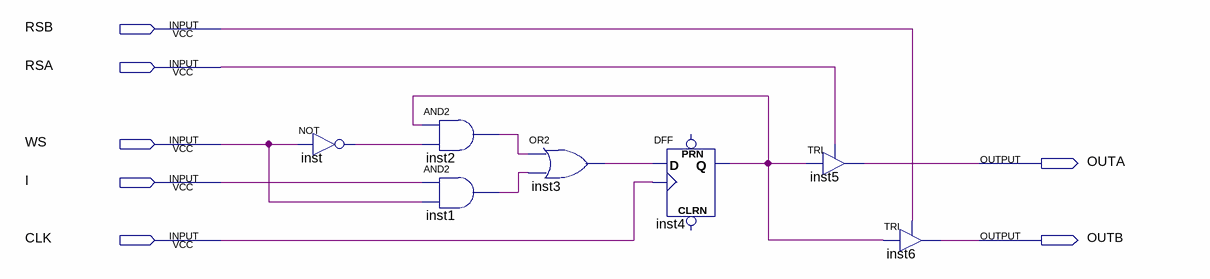
[diagram p0: schematic sheet]
// Quartus schematic RFC.bdf as structural Verilog: 7 symbols, 7 pins
module RFC (
  input  RSB,
  input  RSA,
  input  WS,
  input  I,
  input  CLK,
  output OUTA,
  output OUTB
);

  wire inst1_out, inst2_out, inst3_out, inst4_q, inst_out;

  not inst (inst_out, WS);
  and inst2 (inst2_out, inst4_q, inst_out);
  and inst1 (inst1_out, I, WS);
  or inst3 (inst3_out, inst2_out, inst1_out);
  DFF inst4 (.CLK(CLK), .D(inst3_out), .Q(inst4_q));  // open: CLRN, PRN
  TRI inst5 (.IN(inst4_q), .OE(RSA), .OUT(OUTA));
  TRI inst6 (.IN(inst4_q), .OE(RSB), .OUT(OUTB));
endmodule
